# EAGLE schematic Arranged in Fusion (EAGLE 8.5.0)
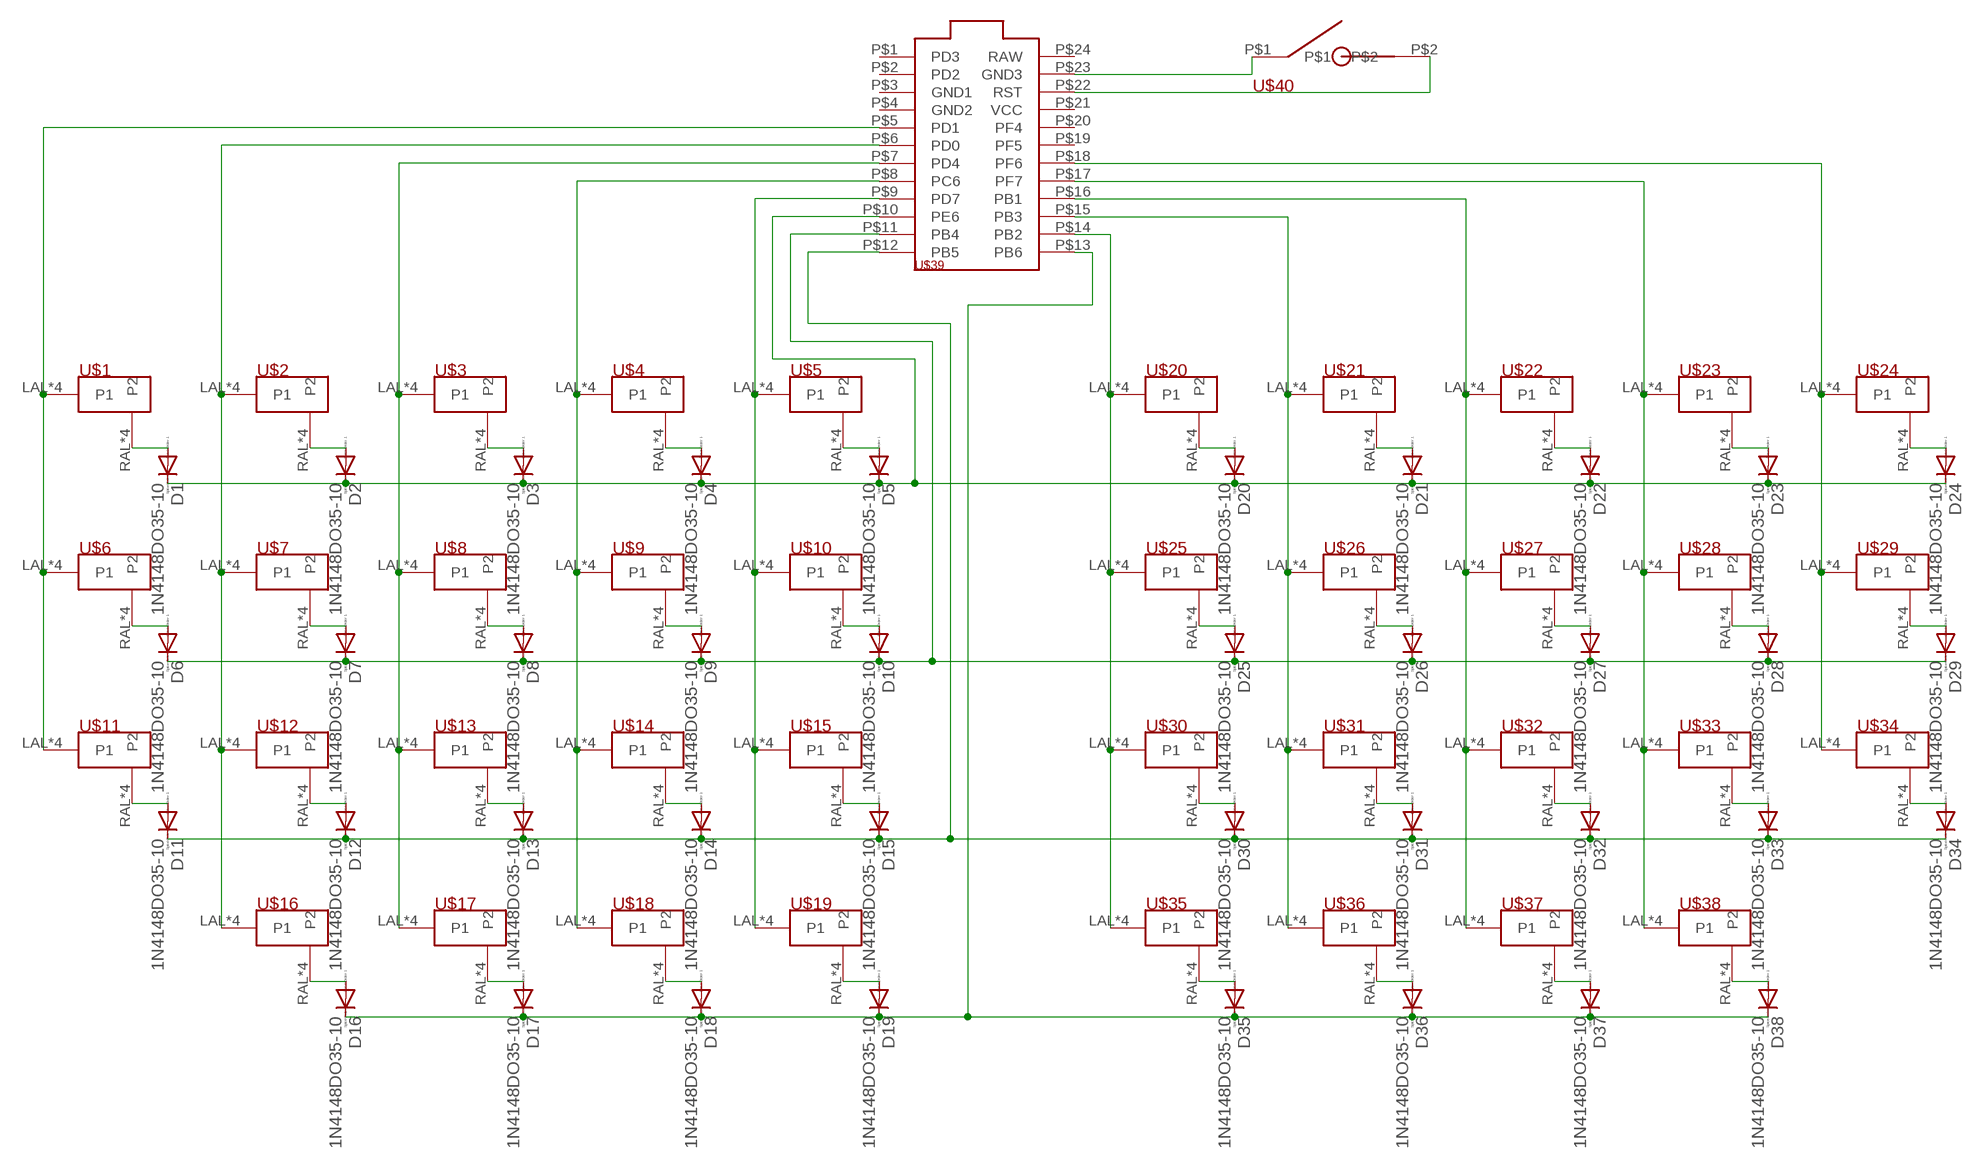
[diagram p0: schematic, sheet 1]

## Parts
D1  1N4148DO35-10  [DO35-10]
D2  1N4148DO35-10  [DO35-10]
D3  1N4148DO35-10  [DO35-10]
D4  1N4148DO35-10  [DO35-10]
D5  1N4148DO35-10  [DO35-10]
D6  1N4148DO35-10  [DO35-10]
D7  1N4148DO35-10  [DO35-10]
D8  1N4148DO35-10  [DO35-10]
D9  1N4148DO35-10  [DO35-10]
D10  1N4148DO35-10  [DO35-10]
D11  1N4148DO35-10  [DO35-10]
D12  1N4148DO35-10  [DO35-10]
D13  1N4148DO35-10  [DO35-10]
D14  1N4148DO35-10  [DO35-10]
D15  1N4148DO35-10  [DO35-10]
D16  1N4148DO35-10  [DO35-10]
D17  1N4148DO35-10  [DO35-10]
D18  1N4148DO35-10  [DO35-10]
D19  1N4148DO35-10  [DO35-10]
D20  1N4148DO35-10  [DO35-10]
D21  1N4148DO35-10  [DO35-10]
D22  1N4148DO35-10  [DO35-10]
D23  1N4148DO35-10  [DO35-10]
D24  1N4148DO35-10  [DO35-10]
D25  1N4148DO35-10  [DO35-10]
D26  1N4148DO35-10  [DO35-10]
D27  1N4148DO35-10  [DO35-10]
D28  1N4148DO35-10  [DO35-10]
D29  1N4148DO35-10  [DO35-10]
D30  1N4148DO35-10  [DO35-10]
D31  1N4148DO35-10  [DO35-10]
D32  1N4148DO35-10  [DO35-10]
D33  1N4148DO35-10  [DO35-10]
D34  1N4148DO35-10  [DO35-10]
D35  1N4148DO35-10  [DO35-10]
D36  1N4148DO35-10  [DO35-10]
D37  1N4148DO35-10  [DO35-10]
D38  1N4148DO35-10  [DO35-10]
U$1  MANDOUBLEONESIDED  [MX/ALPS]
U$2  MANDOUBLEONESIDED  [MX/ALPS]
U$3  MANDOUBLEONESIDED  [MX/ALPS]
U$4  MANDOUBLEONESIDED  [MX/ALPS]
U$5  MANDOUBLEONESIDED  [MX/ALPS]
U$6  MANDOUBLEONESIDED  [MX/ALPS]
U$7  MANDOUBLEONESIDED  [MX/ALPS]
U$8  MANDOUBLEONESIDED  [MX/ALPS]
U$9  MANDOUBLEONESIDED  [MX/ALPS]
U$10  MANDOUBLEONESIDED  [MX/ALPS]
U$11  MANDOUBLEONESIDED  [MX/ALPS]
U$12  MANDOUBLEONESIDED  [MX/ALPS]
U$13  MANDOUBLEONESIDED  [MX/ALPS]
U$14  MANDOUBLEONESIDED  [MX/ALPS]
U$15  MANDOUBLEONESIDED  [MX/ALPS]
U$16  MANDOUBLEONESIDED  [MX/ALPS]
U$17  MANDOUBLEONESIDED  [MX/ALPS]
U$18  MANDOUBLEONESIDED  [MX/ALPS]
U$19  MANDOUBLEONESIDED  [MX/ALPS]
U$20  MANDOUBLEONESIDED  [MX/ALPS]
U$21  MANDOUBLEONESIDED  [MX/ALPS]
U$22  MANDOUBLEONESIDED  [MX/ALPS]
U$23  MANDOUBLEONESIDED  [MX/ALPS]
U$24  MANDOUBLEONESIDED  [MX/ALPS]
U$25  MANDOUBLEONESIDED  [MX/ALPS]
U$26  MANDOUBLEONESIDED  [MX/ALPS]
U$27  MANDOUBLEONESIDED  [MX/ALPS]
U$28  MANDOUBLEONESIDED  [MX/ALPS]
U$29  MANDOUBLEONESIDED  [MX/ALPS]
U$30  MANDOUBLEONESIDED  [MX/ALPS]
U$31  MANDOUBLEONESIDED  [MX/ALPS]
U$32  MANDOUBLEONESIDED  [MX/ALPS]
U$33  MANDOUBLEONESIDED  [MX/ALPS]
U$34  MANDOUBLEONESIDED  [MX/ALPS]
U$35  MANDOUBLEONESIDED  [MX/ALPS]
U$36  MANDOUBLEONESIDED  [MX/ALPS]
U$37  MANDOUBLEONESIDED  [MX/ALPS]
U$38  MANDOUBLEONESIDED  [MX/ALPS]
U$39  PROMICRO  [PROMICRO]
U$40  RSTSW  [SKHL]

## Nets
N$1: D1.A U$1.RAL(P2) U$1.RAR(P2) U$1.RCL(P2) U$1.RCR(P2)
N$2: D2.A U$2.RAL(P2) U$2.RAR(P2) U$2.RCL(P2) U$2.RCR(P2)
N$3: D3.A U$3.RAL(P2) U$3.RAR(P2) U$3.RCL(P2) U$3.RCR(P2)
N$4: D4.A U$4.RAL(P2) U$4.RAR(P2) U$4.RCL(P2) U$4.RCR(P2)
N$5: D5.A U$5.RAL(P2) U$5.RAR(P2) U$5.RCL(P2) U$5.RCR(P2)
N$6: D1.C D2.C D3.C D4.C D5.C D20.C D21.C D22.C D23.C D24.C U$39.P$10(PE6)
N$7: D6.A U$6.RAL(P2) U$6.RAR(P2) U$6.RCL(P2) U$6.RCR(P2)
N$8: D7.A U$7.RAL(P2) U$7.RAR(P2) U$7.RCL(P2) U$7.RCR(P2)
N$9: D8.A U$8.RAL(P2) U$8.RAR(P2) U$8.RCL(P2) U$8.RCR(P2)
N$10: D9.A U$9.RAL(P2) U$9.RAR(P2) U$9.RCL(P2) U$9.RCR(P2)
N$11: D10.A U$10.RAL(P2) U$10.RAR(P2) U$10.RCL(P2) U$10.RCR(P2)
N$12: D11.A U$11.RAL(P2) U$11.RAR(P2) U$11.RCL(P2) U$11.RCR(P2)
N$13: D12.A U$12.RAL(P2) U$12.RAR(P2) U$12.RCL(P2) U$12.RCR(P2)
N$14: D13.A U$13.RAL(P2) U$13.RAR(P2) U$13.RCL(P2) U$13.RCR(P2)
N$15: D14.A U$14.RAL(P2) U$14.RAR(P2) U$14.RCL(P2) U$14.RCR(P2)
N$16: D15.A U$15.RAL(P2) U$15.RAR(P2) U$15.RCL(P2) U$15.RCR(P2)
N$17: D11.C D12.C D13.C D14.C D15.C D30.C D31.C D32.C D33.C D34.C U$39.P$12(PB5)
N$18: D16.A U$16.RAL(P2) U$16.RAR(P2) U$16.RCL(P2) U$16.RCR(P2)
N$19: D17.A U$17.RAL(P2) U$17.RAR(P2) U$17.RCL(P2) U$17.RCR(P2)
N$20: D18.A U$18.RAL(P2) U$18.RAR(P2) U$18.RCL(P2) U$18.RCR(P2)
N$21: D19.A U$19.RAL(P2) U$19.RAR(P2) U$19.RCL(P2) U$19.RCR(P2)
N$22: D16.C D17.C D18.C D19.C D35.C D36.C D37.C D38.C U$39.P$13(PB6)
N$23: D20.A U$20.RAL(P2) U$20.RAR(P2) U$20.RCL(P2) U$20.RCR(P2)
N$24: D21.A U$21.RAL(P2) U$21.RAR(P2) U$21.RCL(P2) U$21.RCR(P2)
N$25: D22.A U$22.RAL(P2) U$22.RAR(P2) U$22.RCL(P2) U$22.RCR(P2)
N$26: D23.A U$23.RAL(P2) U$23.RAR(P2) U$23.RCL(P2) U$23.RCR(P2)
N$27: D24.A U$24.RAL(P2) U$24.RAR(P2) U$24.RCL(P2) U$24.RCR(P2)
N$28: D25.A U$25.RAL(P2) U$25.RAR(P2) U$25.RCL(P2) U$25.RCR(P2)
N$29: D26.A U$26.RAL(P2) U$26.RAR(P2) U$26.RCL(P2) U$26.RCR(P2)
N$30: D27.A U$27.RAL(P2) U$27.RAR(P2) U$27.RCL(P2) U$27.RCR(P2)
N$31: D28.A U$28.RAL(P2) U$28.RAR(P2) U$28.RCL(P2) U$28.RCR(P2)
N$32: D29.A U$29.RAL(P2) U$29.RAR(P2) U$29.RCL(P2) U$29.RCR(P2)
N$33: D30.A U$30.RAL(P2) U$30.RAR(P2) U$30.RCL(P2) U$30.RCR(P2)
N$34: D31.A U$31.RAL(P2) U$31.RAR(P2) U$31.RCL(P2) U$31.RCR(P2)
N$35: D32.A U$32.RAL(P2) U$32.RAR(P2) U$32.RCL(P2) U$32.RCR(P2)
N$36: D33.A U$33.RAL(P2) U$33.RAR(P2) U$33.RCL(P2) U$33.RCR(P2)
N$37: D34.A U$34.RAL(P2) U$34.RAR(P2) U$34.RCL(P2) U$34.RCR(P2)
N$38: D35.A U$35.RAL(P2) U$35.RAR(P2) U$35.RCL(P2) U$35.RCR(P2)
N$39: D36.A U$36.RAL(P2) U$36.RAR(P2) U$36.RCL(P2) U$36.RCR(P2)
N$40: D37.A U$37.RAL(P2) U$37.RAR(P2) U$37.RCL(P2) U$37.RCR(P2)
N$41: D38.A U$38.RAL(P2) U$38.RAR(P2) U$38.RCL(P2) U$38.RCR(P2)
N$42: D6.C D7.C D8.C D9.C D10.C D25.C D26.C D27.C D28.C D29.C U$39.P$11(PB4)
N$43: U$1.LAL(P1) U$1.LAR(P1) U$1.LCL(P1) U$1.LCR(P1) U$6.LAL(P1) U$6.LAR(P1) U$6.LCL(P1) U$6.LCR(P1) U$11.LAL(P1) U$11.LAR(P1) U$11.LCL(P1) U$11.LCR(P1) U$39.P$5(PD1)
N$44: U$2.LAL(P1) U$2.LAR(P1) U$2.LCL(P1) U$2.LCR(P1) U$7.LAL(P1) U$7.LAR(P1) U$7.LCL(P1) U$7.LCR(P1) U$12.LAL(P1) U$12.LAR(P1) U$12.LCL(P1) U$12.LCR(P1) U$16.LAL(P1) U$16.LAR(P1) U$16.LCL(P1) U$16.LCR(P1) U$39.P$6(PD0)
N$45: U$3.LAL(P1) U$3.LAR(P1) U$3.LCL(P1) U$3.LCR(P1) U$8.LAL(P1) U$8.LAR(P1) U$8.LCL(P1) U$8.LCR(P1) U$13.LAL(P1) U$13.LAR(P1) U$13.LCL(P1) U$13.LCR(P1) U$17.LAL(P1) U$17.LAR(P1) U$17.LCL(P1) U$17.LCR(P1) U$39.P$7(PD4)
N$46: U$4.LAL(P1) U$4.LAR(P1) U$4.LCL(P1) U$4.LCR(P1) U$9.LAL(P1) U$9.LAR(P1) U$9.LCL(P1) U$9.LCR(P1) U$14.LAL(P1) U$14.LAR(P1) U$14.LCL(P1) U$14.LCR(P1) U$18.LAL(P1) U$18.LAR(P1) U$18.LCL(P1) U$18.LCR(P1) U$39.P$8(PC6)
N$47: U$5.LAL(P1) U$5.LAR(P1) U$5.LCL(P1) U$5.LCR(P1) U$10.LAL(P1) U$10.LAR(P1) U$10.LCL(P1) U$10.LCR(P1) U$15.LAL(P1) U$15.LAR(P1) U$15.LCL(P1) U$15.LCR(P1) U$19.LAL(P1) U$19.LAR(P1) U$19.LCL(P1) U$19.LCR(P1) U$39.P$9(PD7)
N$48: U$20.LAL(P1) U$20.LAR(P1) U$20.LCL(P1) U$20.LCR(P1) U$25.LAL(P1) U$25.LAR(P1) U$25.LCL(P1) U$25.LCR(P1) U$30.LAL(P1) U$30.LAR(P1) U$30.LCL(P1) U$30.LCR(P1) U$35.LAL(P1) U$35.LAR(P1) U$35.LCL(P1) U$35.LCR(P1) U$39.P$14(PB2)
N$49: U$21.LAL(P1) U$21.LAR(P1) U$21.LCL(P1) U$21.LCR(P1) U$26.LAL(P1) U$26.LAR(P1) U$26.LCL(P1) U$26.LCR(P1) U$31.LAL(P1) U$31.LAR(P1) U$31.LCL(P1) U$31.LCR(P1) U$36.LAL(P1) U$36.LAR(P1) U$36.LCL(P1) U$36.LCR(P1) U$39.P$15(PB3)
N$50: U$22.LAL(P1) U$22.LAR(P1) U$22.LCL(P1) U$22.LCR(P1) U$27.LAL(P1) U$27.LAR(P1) U$27.LCL(P1) U$27.LCR(P1) U$32.LAL(P1) U$32.LAR(P1) U$32.LCL(P1) U$32.LCR(P1) U$37.LAL(P1) U$37.LAR(P1) U$37.LCL(P1) U$37.LCR(P1) U$39.P$16(PB1)
N$51: U$23.LAL(P1) U$23.LAR(P1) U$23.LCL(P1) U$23.LCR(P1) U$28.LAL(P1) U$28.LAR(P1) U$28.LCL(P1) U$28.LCR(P1) U$33.LAL(P1) U$33.LAR(P1) U$33.LCL(P1) U$33.LCR(P1) U$38.LAL(P1) U$38.LAR(P1) U$38.LCL(P1) U$38.LCR(P1) U$39.P$17(PF7)
N$52: U$24.LAL(P1) U$24.LAR(P1) U$24.LCL(P1) U$24.LCR(P1) U$29.LAL(P1) U$29.LAR(P1) U$29.LCL(P1) U$29.LCR(P1) U$34.LAL(P1) U$34.LAR(P1) U$34.LCL(P1) U$34.LCR(P1) U$39.P$18(PF6)
N$54: U$39.P$23(GND3) U$40.P$1
N$55: U$39.P$22(RST) U$40.P$2
Unconnected: U$39.P$1(PD3) U$39.P$2(PD2) U$39.P$3(GND1) U$39.P$4(GND2) U$39.P$19(PF5) U$39.P$20(PF4) U$39.P$21(VCC) U$39.P$24(RAW)

## Library data of the parts
D1-D38 = diode:1N4148: DIODE high speed (Philips)
U$1-U$38 = Keys:MANDOUBLE
U$39 = Keys:PROMICRO
U$40 = Keys:RSTSW